# EAGLE design Voltage Regulator Board (EAGLE 9.2.2)
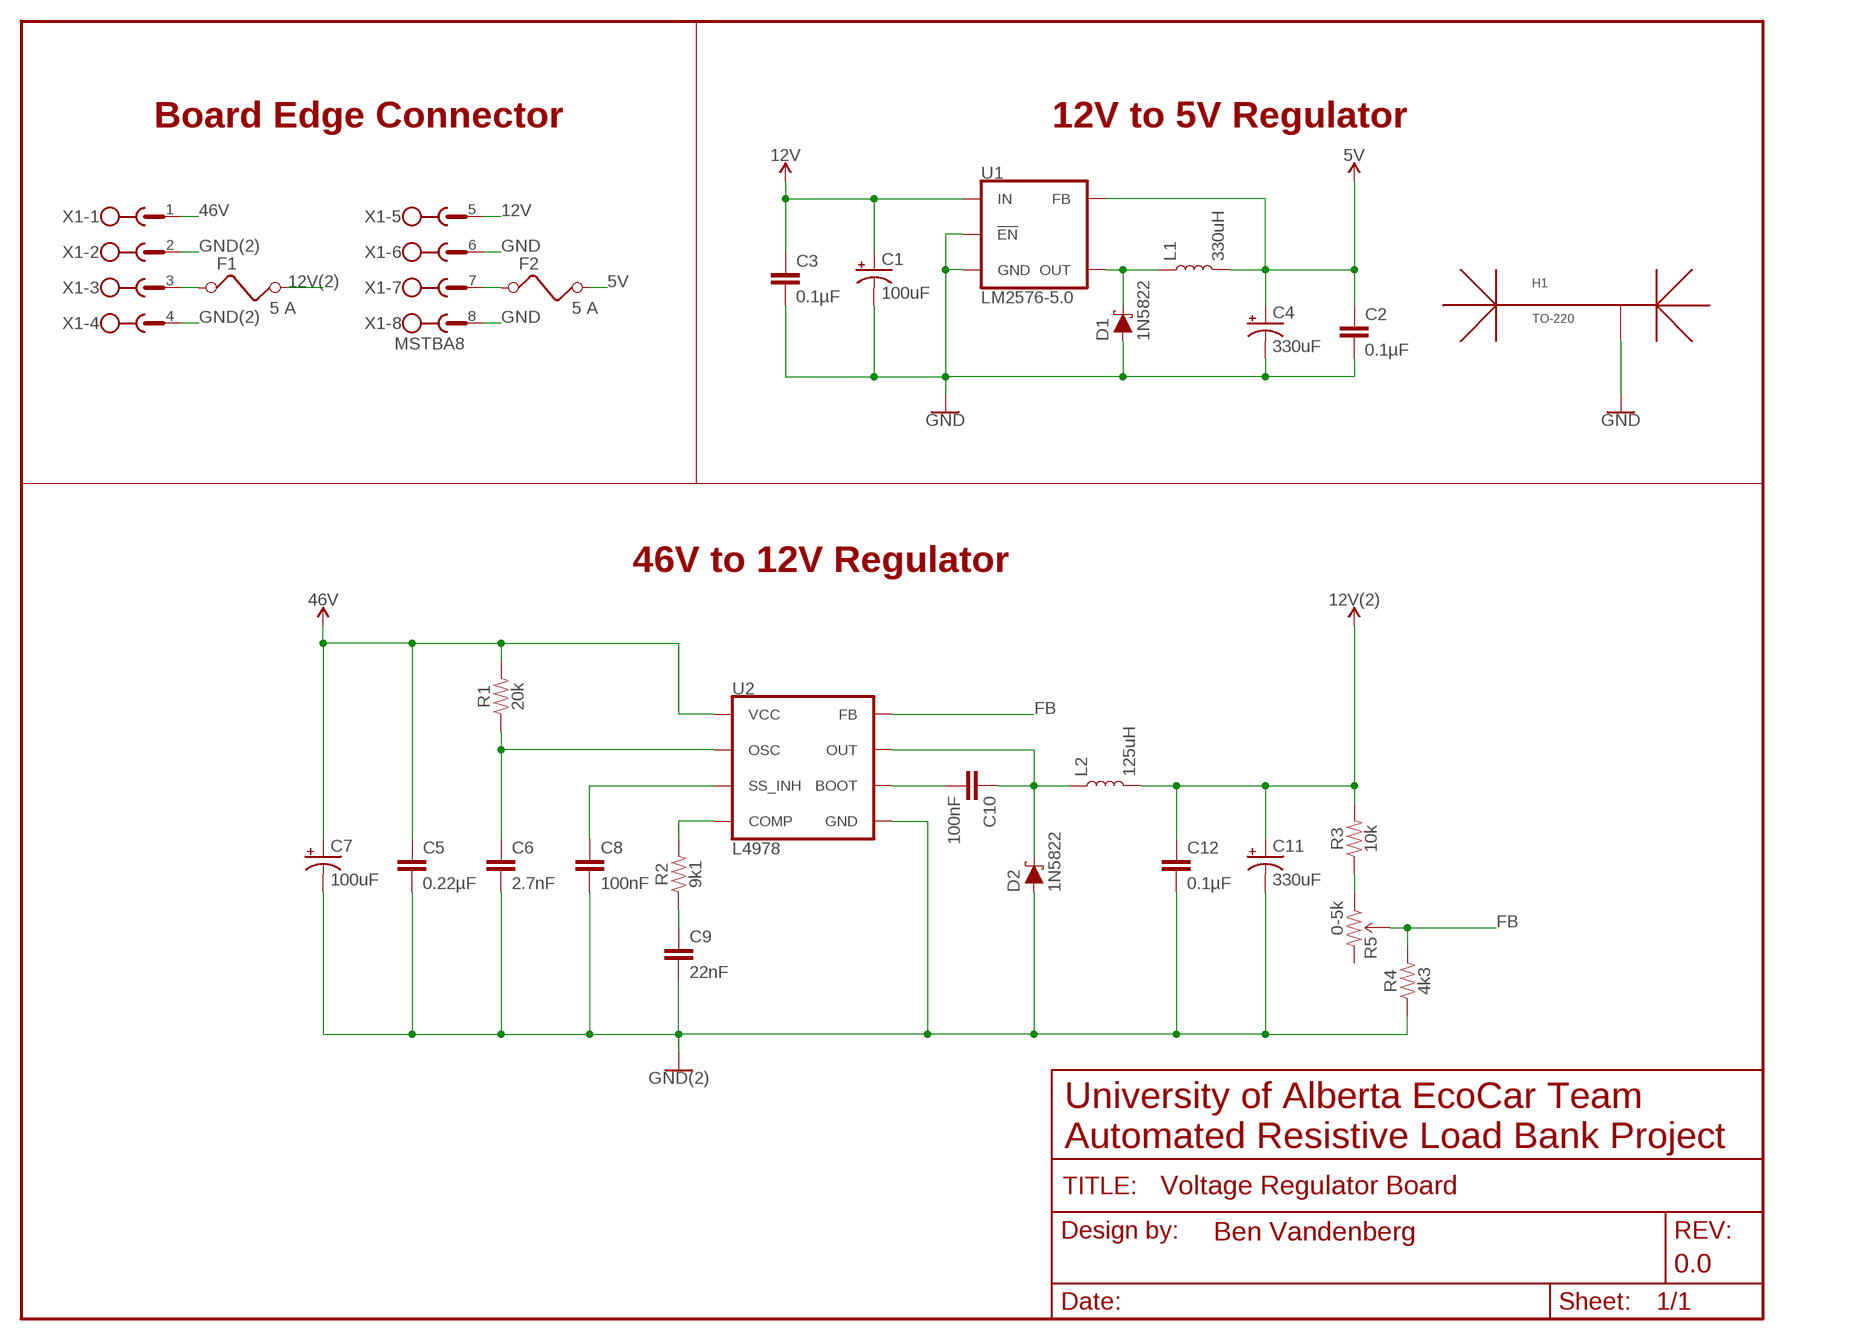
[diagram p0: schematic, sheet 1]

## Parts
C1  100uF  100UF_POLAR_CAP_WURTH  [CPOL-RADIAL-3.5MM-8MM]
C2  0.1µF  0.33UF/330NF-0805-50V-10%  [0805]
C3  0.1µF  0.33UF/330NF-0805-50V-10%  [0805]
C4  330uF  330UF_POLAR_CAP_PANASONIC  [CPOL-RADIAL-5MM-10MM]
C5  0.22µF  0.33UF/330NF-0805-50V-10%  [0805]
C6  2.7nF  0.33UF/330NF-0805-50V-10%  [0805]
C7  100uF  100UF_POLAR_CAP_WURTH  [CPOL-RADIAL-3.5MM-8MM]
C8  100nF  0.33UF/330NF-0805-50V-10%  [0805]
C9  22nF  0.33UF/330NF-0805-50V-10%  [0805]
C10  100nF  0.33UF/330NF-0805-50V-10%  [0805]
C11  330uF  330UF_POLAR_CAP_PANASONIC  [CPOL-RADIAL-5MM-10MM]
C12  0.1µF  0.33UF/330NF-0805-50V-10%  [0805]
D1  1N5822  1N5822_SCHOTTKY_DIODE  [DO201T15]
D2  1N5822  1N5822_SCHOTTKY_DIODE  [DO201T15]
F1  5 A  KEYSTONE_ATM_FUSEHOLDER  [KEYSTONE_ATM_FUSEHOLDER]
F2  5 A  KEYSTONE_ATM_FUSEHOLDER  [KEYSTONE_ATM_FUSEHOLDER]
FRAME1  FRAME-LETTERNO_PACKAGE  [DUMMY]
H1  TO-220  HSE-B630-04H_HEATSINK  [HSE-B250-04H_HEATSINK]
L1  330uH  HCTI-330-5.2_TOROIDAL_INDUCTOR  [330UH_PTH_INDUCTOR]
L2  125uH  1536W_RF_CHOKE  [125UH_PTH_INDUCTOR]
R1  20k  0.75OHM-0805-1/4W-1%  [0805]
R2  9k1  0.75OHM-0805-1/4W-1%  [0805]
R3  10k  0.75OHM-0805-1/4W-1%  [0805]
R4  4k3  0.75OHM-0805-1/4W-1%  [0805]
R5  0-5k  CT6EP502_TRIM_POT  [TRIM_POT]
U1  LM2576-5.0  LM2576_5-0_VOLTAGE_REG  [TO220-5]
U2  L4978  L4978_VOLTAGE_REG  [DIP08]
X1  MSTBA8  [MSTBA8]

## Nets
5V: C2.1 C4.+ F2.R1 F2.R2 L1.P$2 U1.4(FB)
12V: C1.+ C3.1 U1.1(IN) X1.5
12V(2): C11.+ C12.1 F1.R1 F1.R2 L2.P$2 R3.2
46V: C5.1 C7.+ R1.2 U2.5(VCC) X1.1
FB: R4.2 R5.2(WIPER) U2.8(FB)
GND: C1.- C2.2 C3.2 C4.- D1.A H1.GND@1(GND) H1.GND@2(GND) U1.3(GND) U1.5(!EN) X1.6 X1.8
GND(2): C5.2 C6.2 C7.- C8.2 C9.2 C11.- C12.2 D2.A R4.1 U2.1(GND) X1.2 X1.4
N$1: F1.L1 F1.L2 X1.3
N$2: C6.1 R1.1 U2.3(OSC)
N$3: C8.1 U2.2(SS_INH)
N$4: R2.2 U2.7(COMP)
N$5: C9.1 R2.1
N$6: F2.L1 F2.L2 X1.7
N$7: C10.2 U2.6(BOOT)
N$8: C10.1 D2.C L2.P$1 U2.4(OUT)
N$9: R3.1 R5.1(CCW)
OUT: D1.C L1.P$1 U1.2(OUT)
Unconnected: R5.3(CW)

## Notes on the sheet
- Board Edge Connector | 12V to 5V Regulator
- 46V to 12V Regulator
- University of Alberta EcoCar Team
  Automated Resistive Load Bank Project

## Library data of the parts
C1 C7 = CustomLibrary:100UF_POLAR_CAP_WURTH: Electrolytic Capacitor Wurth WCAP-ATG8 100uF 50V 3.5mm lead spacing, 8mm case diameter
C2 C3 C5 C6 C8-C10 C12 = SparkFun-Capacitors:0.33UF/330NF: 0.33µF/330nF ceramic capacitors A capacitor is a passive two-terminal electrical component used to store electrical energy temporarily in an electric field.; PROD_ID: CAP-08469; VALUE: 0.33µF
C4 C11 = CustomLibrary:330UF_POLAR_CAP_PANASONIC: Polarized Capacitor Panasonic ECA-1HM331 330uF 20% 50V Radial
D1 D2 = CustomLibrary:1N5822_SCHOTTKY_DIODE: Schottky Diode 1N5822 - 3A 40V
F1 F2 = CustomLibrary:KEYSTONE_ATM_FUSEHOLDER; VALUE: ? A
FRAME1 = SparkFun-Aesthetics:FRAME-LETTER: Schematic Frame - Letter Standard 8.5x11 US Letter frame; DESIGNER: Ben Vandenberg; REV: 0.0; VERSION: v01
H1 = CustomLibrary:HSE-B630-04H_HEATSINK
L1 = CustomLibrary:HCTI-330-5.2_TOROIDAL_INDUCTOR: Toroidal Inductor Signal Transformer HCTI-330-5.2 330uH 5.2A 67mOhm Wirewound
L2 = CustomLibrary:1536W_RF_CHOKE: Inductor Hammond 1536W, 0.08ohm, 3.5A
R1-R4 = SparkFun-Resistors:0.75OHM: 0.75Ω resistor A resistor is a passive two-terminal electrical component that implements electrical resistance as a circuit element. Resistors act to reduce current flow, and, at the same time, act to lower voltage levels within circuits. - Wikipedia; PROD_ID: RES-08474; VALUE: 0.75
R5 = CustomLibrary:CT6EP502_TRIM_POT: Trimmer Potentiometer Nidec Copal CT6EP502 5k 0.5W
U1 = CustomLibrary:LM2576_5-0_VOLTAGE_REG: Voltage Regulator LM2576-5.0 5V 3A fixed switching regulator in TO-220-5 package
U2 = CustomLibrary:L4978_VOLTAGE_REG: Voltage Regulator LM4978 Adjustable Voltage Regulator 2A, 8V-55V input, 3.3V±1.0% internal reference, 3.3V-50V output, up to 300kHz switching frequency
X1 = con-phoenix-508:MSTBA8: PHOENIX; MF: FARNELL; MPN: 1757307; OC_FARNELL: 3705225; OC_NEWARK: 71C4166

## Board
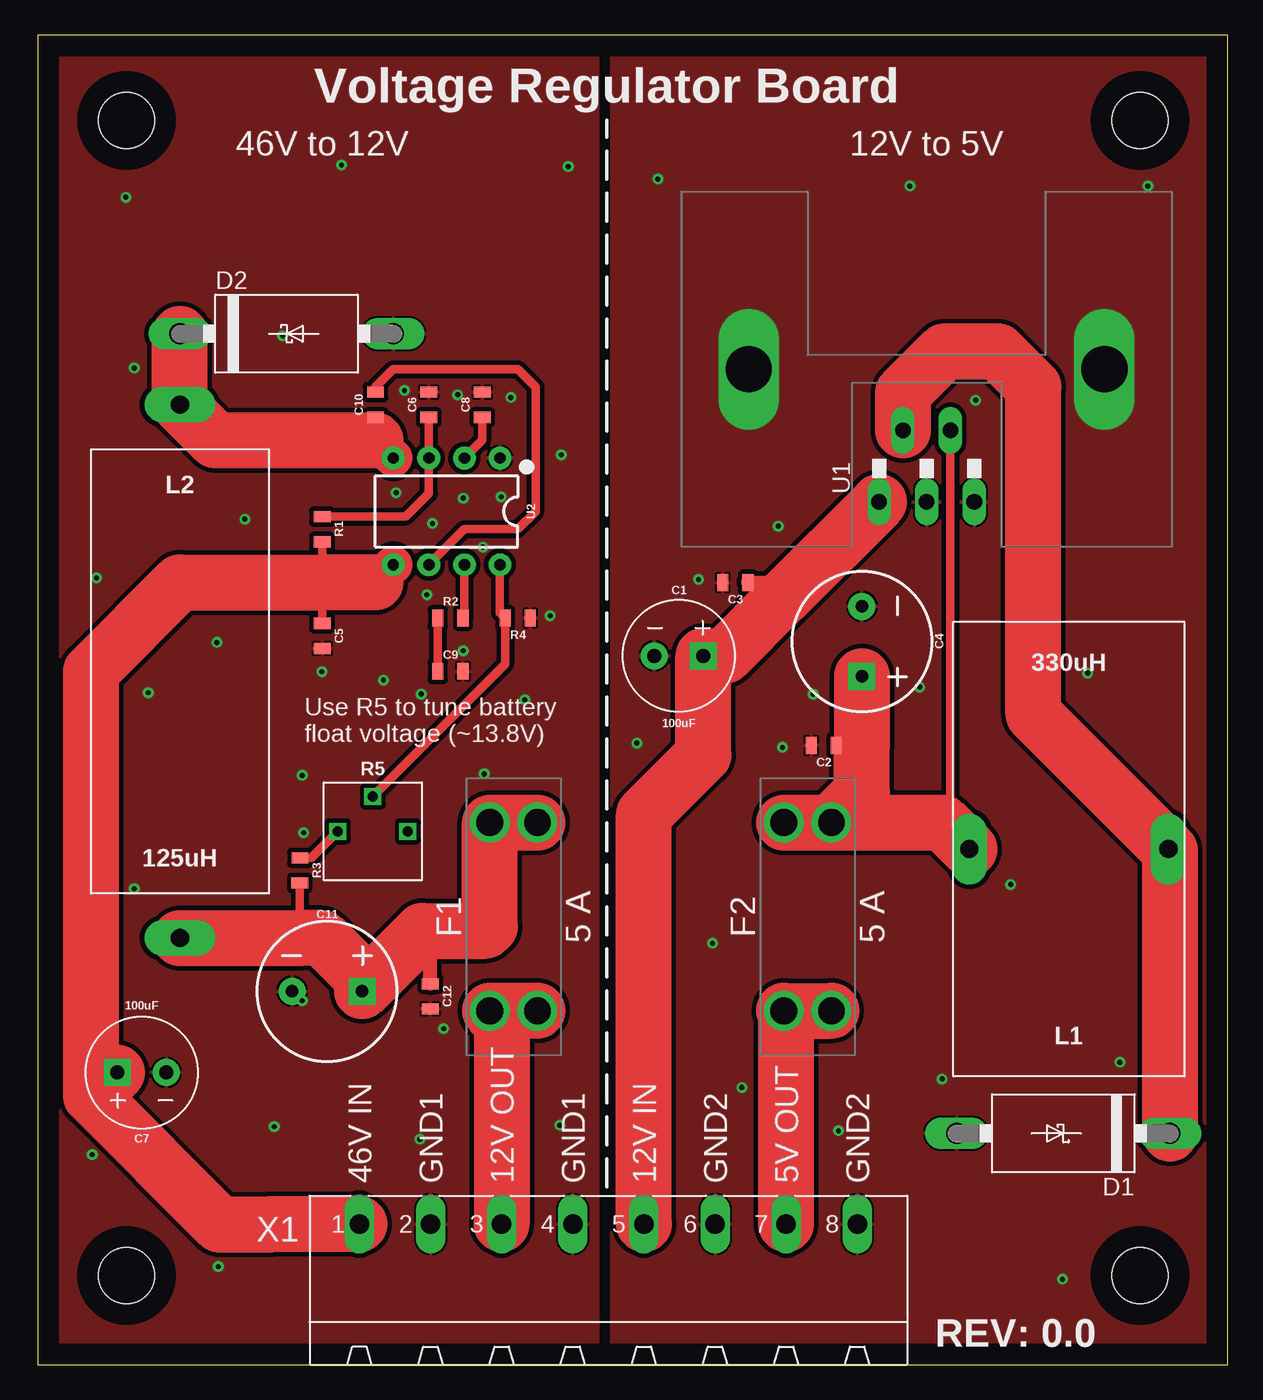
[diagram p1: board, top side]
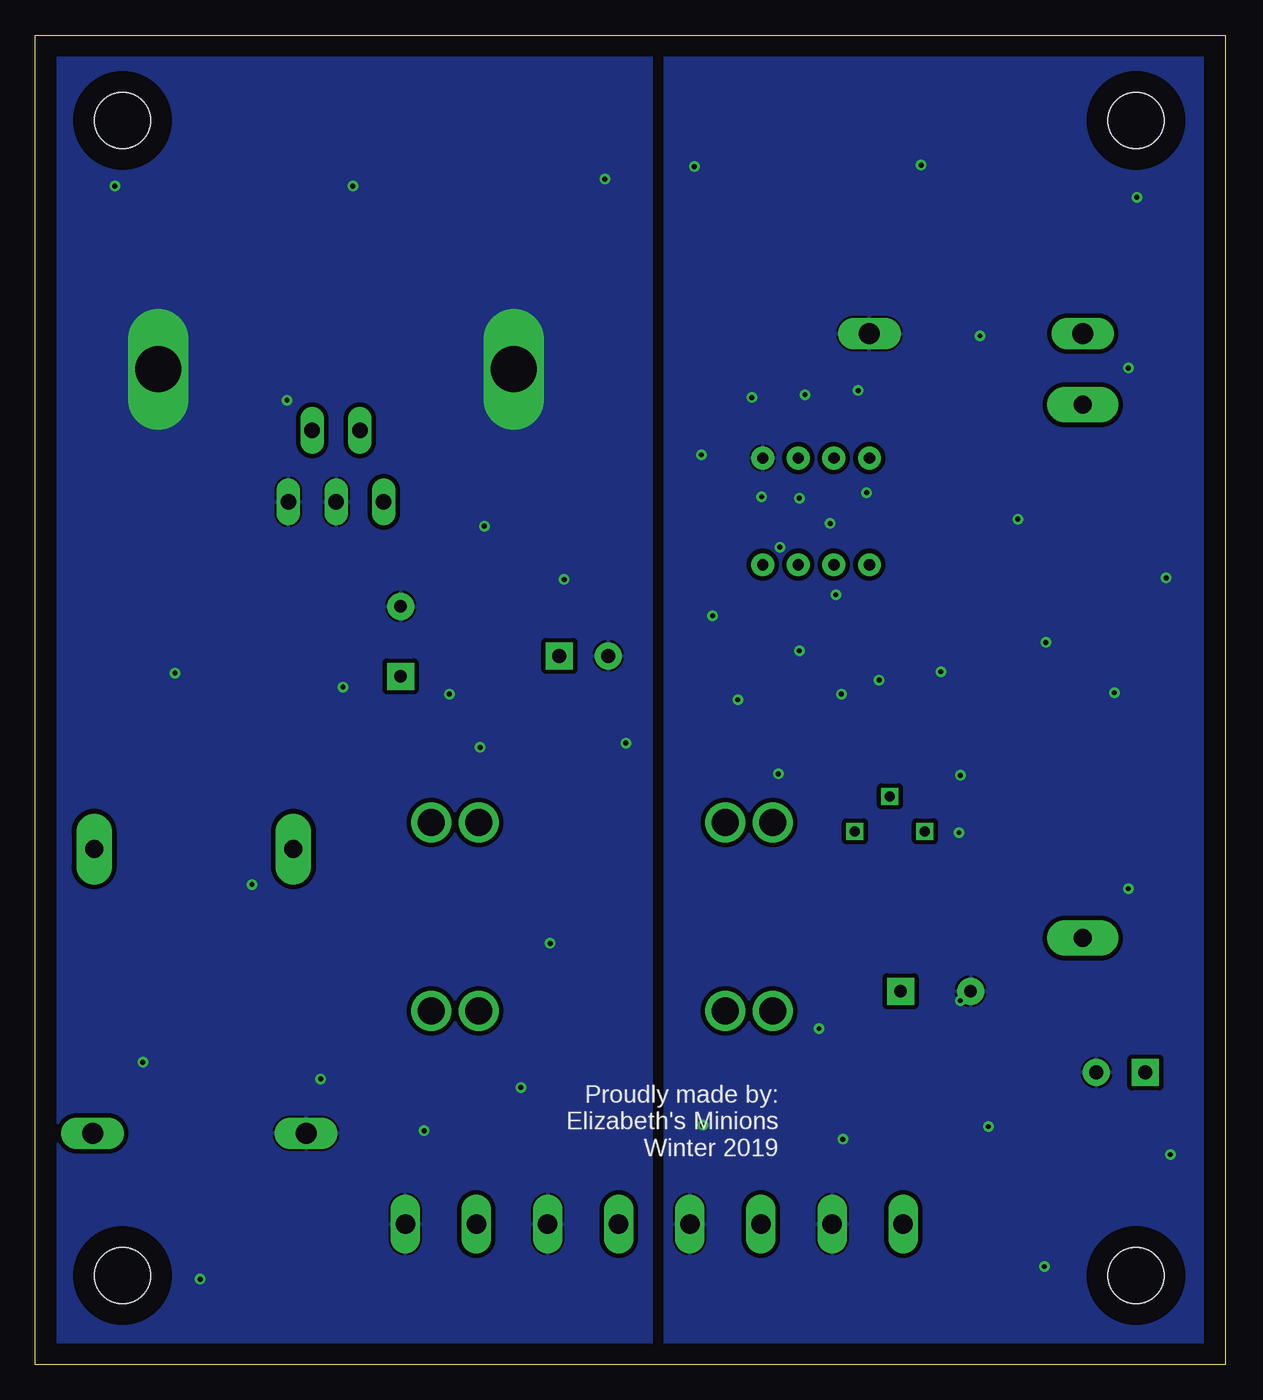
[diagram p2: board, bottom side, seen from below]

Size 85 x 95 mm. Coordinates in mm from the lower left corner, seen from the top.
Outline: 0,0 85,0 85,95 0,95 0,0
Copper layers (1*16): Top 0.035mm / dielectric 1.5mm / Bottom 0.035mm
Design rules "default *": minimum track width 6mil, minimum drill 0.35mm, track to track 13mil, track to pad 13mil, pad to pad 13mil, via to via 13mil, smd to smd 6mil, copper to edge 60mil, drill to drill 8mil, minimum pad ring 10mil, minimum via ring 8mil, stop-mask expansion 4mil, vias tented up to drill 0mil, thermal gap 6mil
Holes 4 mm at 6.35,88.9 6.35,6.35 78.74,6.35 78.74,88.9

### Footprints (pad centres in the part's own frame; a part is rotated, then mirrored left to right if it is on the bottom)
CPOL-RADIAL-3.5MM-8MM = drill 1 pad 1.93 square: + 1.75,0 | drill 1 pad 1.93: - -1.75,0
0805 = smd 0.8 x 1.2: 1 -0.9,0; 2 0.9,0
CPOL-RADIAL-5MM-10MM = drill 0.9 pad 1.93 square: + 2.5,0 | drill 0.9 pad 1.93: - -2.5,0
DO201T15 = drill 1.499 long: A 7.62,0; C -7.62,0
KEYSTONE_ATM_FUSEHOLDER = drill 1.905: L1 -6.731,1.702; L2 -6.731,-1.702; R1 6.731,1.702; R2 6.731,-1.702
HSE-B250-04H_HEATSINK = drill 3.3 long: GND@1 0,12.7; GND@2 0,-12.7
330UH_PTH_INDUCTOR = drill 1.3 pad 2.54 long: P$1 -7.112,0; P$2 7.112,0
125UH_PTH_INDUCTOR = drill 1.3 pad 2.54 long: P$1 0,19.05; P$2 0,-19.05
TRIM_POT = drill 0.7 square: 1 -2.5,0; 2 0,2.5; 3 2.5,0
TO220-5 = drill 1.118 pad 1.626 long: 1 -3.404,-8.211; 2 -1.702,-3.105; 3 0,-8.211; 4 1.702,-3.105; 5 3.404,-8.211
DIP08 = drill 0.813 pad 1.626: 1 -3.81,-3.81; 2 -1.27,-3.81; 3 1.27,-3.81; 4 3.81,-3.81; 5 3.81,3.81; 6 1.27,3.81; 7 -1.27,3.81; 8 -3.81,3.81
MSTBA8 = drill 1.397 long: 1 -17.78,5.08; 2 -12.7,5.08; 3 -7.62,5.08; 4 -2.54,5.08; 5 2.54,5.08; 6 7.62,5.08; 7 12.7,5.08; 8 17.78,5.08

### Placement (x,y rotation side)
C1  45.8,50.64 0 top
C2  56.15,44.24 180 top
C3  49.83,55.88 180 top
C4  58.88,51.67 270 top
C5  20.32,52.07 270 top
C6  27.94,68.58 90 top
C7  7.43,20.86 180 top
C8  31.75,68.58 90 top
C9  29.48,49.53 0 top
C10  24.13,68.58 90 top
C11  20.67,26.67 0 top
C12  28.05,26.31 270 top
D1  73.26,16.51 180 top
D2  17.78,73.66 0 top
F1  34,32 90 top
F2  55,32 90 top
FRAME1  -0.86,-0.79 0 top
H1  63.5,71.12 270 top
L1  73.66,36.83 180 top
L2  10.16,49.53 0 top
R1  20.32,59.69 270 top
R2  29.48,53.34 0 top
R3  18.73,35.31 269.5 top
R4  34.29,53.34 180 top
R5  23.94,38.1 0 top
U1  63.5,69.85 0 top
U2  29.21,60.96 180 top
X1  40.77,4.95 0 top

### Tracks (layer width: path | path; a pad name or v marks a point on that pad's centre or on a via)
5V
  Top 0.61: U1.4 65.2,38.18 L1.P$2 | C2.1 58.88,44.24
  Top 4: C4.+ 58.88,44.24 58.88,40.91 F2.R2 | F2.R1 F2.R2 | F2.R2 64.65,38.73 L1.P$2
12V
  Top 1: C3.1 52.12,55.88 53.23,54.77
  Top 4: X1.5 43.31,39.31 47.55,43.55 C1.+ 49.1,50.64 53.23,54.77 U1.1
12V(2)
  Top 0.61: R3.2 18.73,30.48
  Top 1: C12.1 28,27.26 28,30.5 27.5,31
  Top 4: L2.P$2 18.73,30.48 20.32,30.48 23.17,27.63 C11.+ 27.5,31 32,31 32.3,31.3 F1.R1 F1.R2
46V
  Top 0.61: R1.2 20.32,55.88 C5.1
  Top 2.7: U2.5 24.13,55.88
  Top 4: X1.1 16.64,10.03 16.6,10 13,10 3.81,19.19 | 3.81,19.19 3.81,49.53 10.16,55.88 20.32,55.88 24.13,55.88 | C7.+ 4.01,19.19 3.81,19.19
FB
  Top 0.61: U2.8 33.02,53.71 R4.2 33.39,50.05 R5.2
GND  (via drill 0.35)
  other vias: 64.6,20.4 57.2,16.7 50.3,19.8 69.5,34.3 77.3,21.6 48.2,30.1 42.8,44.4 52.9,59.9 55.4,47.9 63,48.4 67,68.9 44.3,84.7 62.3,84.2 79.3,84.2 75,49.4 53.2,44.1 47.2,56.1 73.2,6.1
  pour Top (isolate 0.305): 41,0 41,95 85,95 85,0
  pour Bottom (isolate 0.305): 41,0 41,95 85,95 85,0
GND(2)  (via drill 0.35)
  other vias: 19,38 37.3,17.1 27.3,16.1 18.9,26 16.9,17 12.9,7 3.9,15 6.9,34 7.9,48 20.3,49.5 24.7,48.9 36.6,53.5 12.8,51.6 14.8,60.4 4.2,56.2 28.2,60.1 30.4,61.9 33.1,62 25.6,62.3 31.8,58.4 27.8,55 34.8,47.5 31.9,42.2 18.9,42.1 37.9,85.6 21.7,85.7 6.3,83.4 17.5,73.5 6.9,71.2 37.4,65 33.8,69.1 30,69.3 26.2,69.6 27.4,47.9 30.4,51 29,24
  pour Top (isolate 0.305): 0,0 0,95 40,95 40,0
  pour Bottom (isolate 0.305): 0,0 0,95 40,95 40,0
N$1
  Top 4: F1.L2 F1.L1 33.15,24.42 X1.3
N$2
  Top 0.61: C6.1 U2.3 27.94,62.23 26.3,60.59 R1.1
N$3
  Top 0.61: C8.1 31.75,66.04 U2.2
N$4
  Top 0.61: U2.7 30.48,53.44 R2.2
N$5
  Top 0.61: R2.1 C9.1
N$6
  Top 4: X1.7 53.47,25.1 F2.L1 F2.L2
N$7
  Top 0.61: U2.6 30.48,59.69 34.29,59.69 35.56,60.96 35.56,69.85 34.29,71.12 25.4,71.12 24.13,69.85 C10.2
N$8
  Top 0.61: 24.13,66.04 C10.1
  Top 2.7: 24.13,66.04 U2.4
  Top 4: 24.13,66.04 12.7,66.04 L2.P$1 D2.C
N$9
  Top 0.61: R5.1 19.55,36.21 R3.1
OUT
  Top 4: U1.2 61.8,69.42 64.77,72.39 68.58,72.39 71.12,69.85 71.12,46.48 L1.P$1 80.88,36.72 D1.C

### Text on the board
tPlace: Voltage Regulator Board | 46V to 12V | 12V to 5V | Use R5 to tune battery / float voltage (~13.8V) | 46V IN | GND1 | 12V OUT | GND1 | 12V IN | GND2 | 5V OUT | GND2 | REV: 0.0
bPlace: Proudly made by: / Elizabeth's Minions / Winter 2019